# Altium schematic sheet Cell Holders.SchDoc
size A4; SheetNumber: 4; SheetTotal: 8
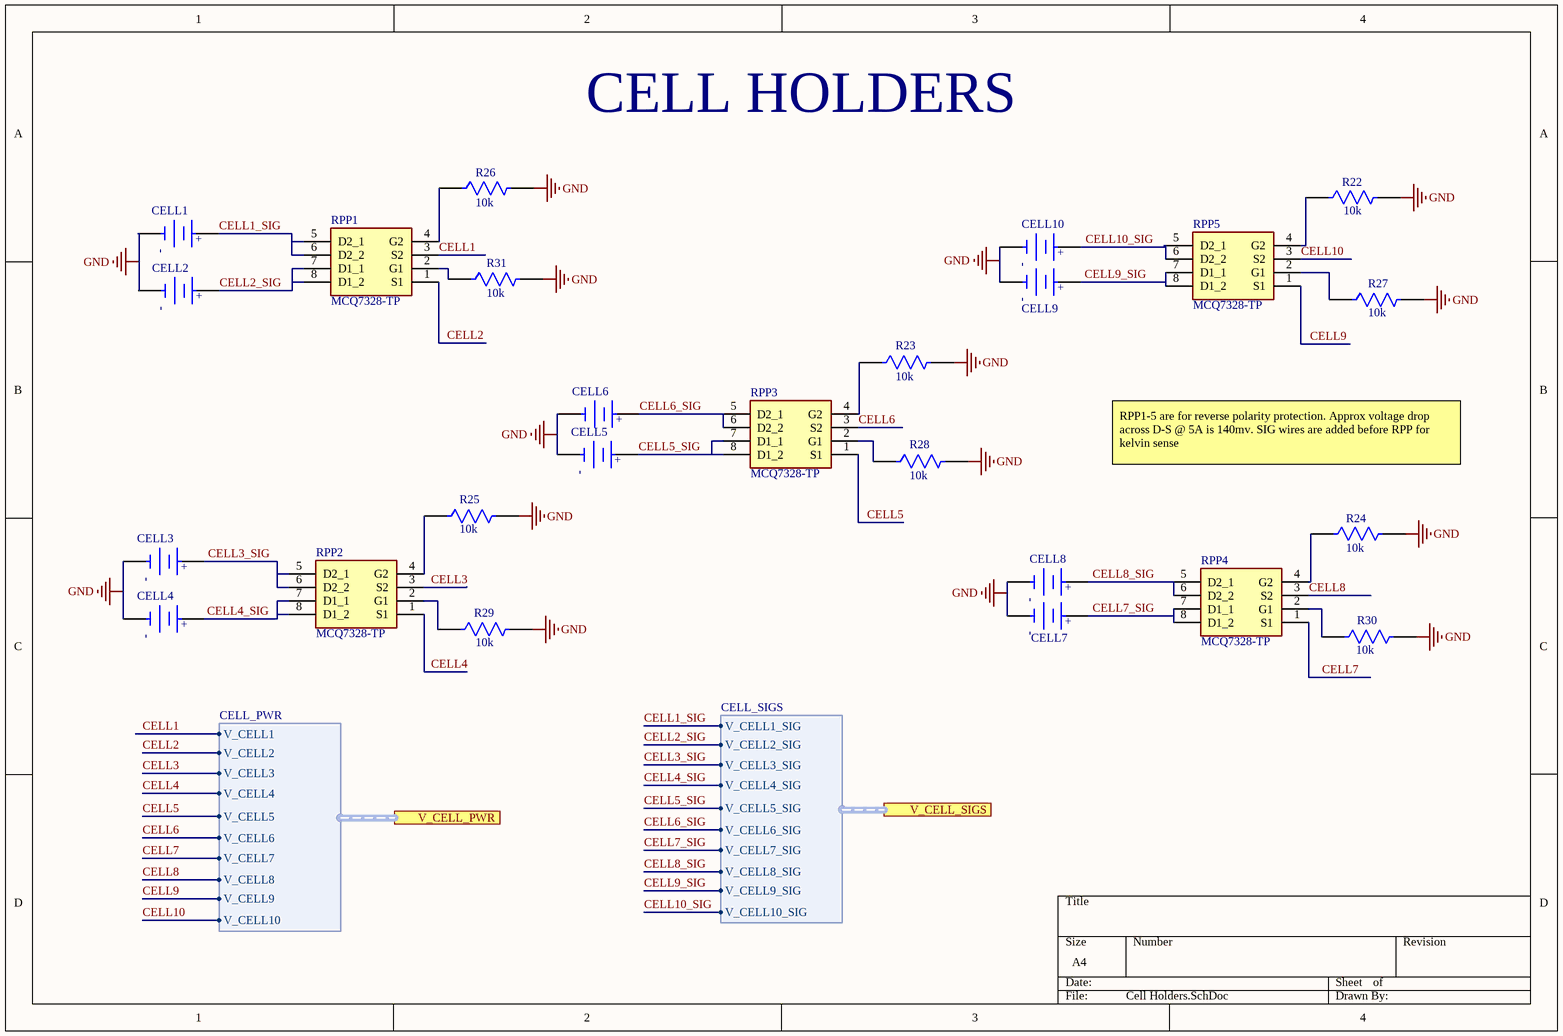
[diagram p0: Cell Holders.SchDoc]

## Parts
CELL1  1042P  [FP-1042P-MFG]  (value not drawn)
CELL2  1042P  [FP-1042P-MFG]  (value not drawn)
CELL3  1042P  [FP-1042P-MFG]  (value not drawn)
CELL4  1042P  [FP-1042P-MFG]  (value not drawn)
CELL5  1042P  [FP-1042P-MFG]  (value not drawn)
CELL6  1042P  [FP-1042P-MFG]  (value not drawn)
CELL7  1042P  [FP-1042P-MFG]  (value not drawn)
CELL8  1042P  [FP-1042P-MFG]  (value not drawn)
CELL9  1042P  [FP-1042P-MFG]  (value not drawn)
CELL10  1042P  [FP-1042P-MFG]  (value not drawn)
R22  10k  [FP-AC0603-IPC_A]
R23  10k  [FP-AC0603-IPC_A]
R24  10k  [FP-AC0603-IPC_A]
R25  10k  [FP-AC0603-IPC_A]
R26  10k  [FP-AC0603-IPC_A]
R27  10k  [FP-AC0603-IPC_A]
R28  10k  [FP-AC0603-IPC_A]
R29  10k  [FP-AC0603-IPC_A]
R30  10k  [FP-AC0603-IPC_A]
R31  10k  [FP-AC0603-IPC_A]
RPP1  MCQ7328-TP  [SOIC127P600X175-8N]
RPP2  MCQ7328-TP  [SOIC127P600X175-8N]
RPP3  MCQ7328-TP  [SOIC127P600X175-8N]
RPP4  MCQ7328-TP  [SOIC127P600X175-8N]
RPP5  MCQ7328-TP  [SOIC127P600X175-8N]

## Ports
V_CELL_PWR (harness CELL_PWR), V_CELL_SIGS (harness CELL_SIGS)

## Harnesses
CELL_PWR: V_CELL1, V_CELL2, V_CELL3, V_CELL4, V_CELL5, V_CELL6, V_CELL7, V_CELL8, V_CELL9, V_CELL10
CELL_SIGS: V_CELL1_SIG, V_CELL2_SIG, V_CELL3_SIG, V_CELL4_SIG, V_CELL5_SIG, V_CELL6_SIG, V_CELL7_SIG, V_CELL8_SIG, V_CELL9_SIG, V_CELL10_SIG

## Nets
GND: CELL1.1(C) CELL3.1(C) CELL4.1(C) CELL5.1(C) CELL6.1(C) CELL7.1(C) CELL8.1(C) CELL9.1(C) CELL10.1(C) R22.2 R23.2 R24.2 R25.2 R26.2 R27.2 R28.2 R29.2 R30.2 R31.2
CELL1: RPP1.3(S2) ; port V_CELL_PWR.V_CELL1
CELL1_SIG: CELL1.2(A) RPP1.5(D2_1) RPP1.6(D2_2) ; port V_CELL_SIGS.V_CELL1_SIG
CELL2: RPP1.1(S1) ; port V_CELL_PWR.V_CELL2
CELL2_SIG: CELL2.2(A) RPP1.7(D1_1) RPP1.8(D1_2) ; port V_CELL_SIGS.V_CELL2_SIG
CELL3: RPP2.3(S2) ; port V_CELL_PWR.V_CELL3
CELL3_SIG: CELL3.2(A) RPP2.5(D2_1) RPP2.6(D2_2) ; port V_CELL_SIGS.V_CELL3_SIG
CELL4: RPP2.1(S1) ; port V_CELL_PWR.V_CELL4
CELL4_SIG: CELL4.2(A) RPP2.7(D1_1) RPP2.8(D1_2) ; port V_CELL_SIGS.V_CELL4_SIG
CELL5: RPP3.1(S1) ; port V_CELL_PWR.V_CELL5
CELL5_SIG: CELL5.2(A) RPP3.7(D1_1) RPP3.8(D1_2) ; port V_CELL_SIGS.V_CELL5_SIG
CELL6: RPP3.3(S2) ; port V_CELL_PWR.V_CELL6
CELL6_SIG: CELL6.2(A) RPP3.5(D2_1) RPP3.6(D2_2) ; port V_CELL_SIGS.V_CELL6_SIG
CELL7: RPP4.1(S1) ; port V_CELL_PWR.V_CELL7
CELL7_SIG: CELL7.2(A) RPP4.7(D1_1) RPP4.8(D1_2) ; port V_CELL_SIGS.V_CELL7_SIG
CELL8: RPP4.3(S2) ; port V_CELL_PWR.V_CELL8
CELL8_SIG: CELL8.2(A) RPP4.5(D2_1) RPP4.6(D2_2) ; port V_CELL_SIGS.V_CELL8_SIG
CELL9: RPP5.1(S1) ; port V_CELL_PWR.V_CELL9
CELL9_SIG: CELL9.2(A) RPP5.7(D1_1) RPP5.8(D1_2) ; port V_CELL_SIGS.V_CELL9_SIG
CELL10: RPP5.3(S2) ; port V_CELL_PWR.V_CELL10
CELL10_SIG: CELL10.2(A) RPP5.5(D2_1) RPP5.6(D2_2) ; port V_CELL_SIGS.V_CELL10_SIG
NetR22_1: R22.1 RPP5.4(G2)
NetR23_1: R23.1 RPP3.4(G2)
NetR24_1: R24.1 RPP4.4(G2)
NetR25_1: R25.1 RPP2.4(G2)
NetR26_1: R26.1 RPP1.4(G2)
NetR27_1: R27.1 RPP5.2(G1)
NetR28_1: R28.1 RPP3.2(G1)
NetR29_1: R29.1 RPP2.2(G1)
NetR30_1: R30.1 RPP4.2(G1)
NetR31_1: R31.1 RPP1.2(G1)

Not connected (* = marked no-connect by the designer): CELL2 1(C)

## Notes on the sheet
- CELL HOLDERS
- RPP1-5 are for reverse polarity protection. Approx voltage drop across D-S @ 5A is 140mv. SIG wires are added before RPP for kelvin sense
- (in symbol CMP-19636-000019-1) +; -

## Library data of the parts
CELL1-CELL10 = CMP-19636-000019-1: BATTERY HOLDER 18650 SMD TAB; Number of Cells: 1; Max Operating Temperature: 145°C; Termination: SMD/SMT; Mount: Surface Mount; Min Operating Temperature: -50°C; Package Quantity: 200; Packaging: Tray; Lead Free: Lead Free
R22-R31 = CMP-03412-040683-1: RES 10kΩ 5.00% 0.2W 0603
RPP1-RPP5 = MCQ7328-TP: Integrated Circuit; Manufacturer_Name: MCC; Datasheet Link: https://www.mccsemi.com/pdf/Products/MCQ7328(SOP-8).pdf; Height: 1.75mm; Manufacturer_Part_Number: MCQ7328-TP